# Altium schematic sheet balancingrobot.SchDoc: Balancing Robot
size A4; Organization: HCMUT; Address1: 268 Li Thuong Kiet; Address2: District 10; Address3: Ho Chi Minh City; Address4: Viet Nam; Revision: 1.0.0; SheetNumber: 1; SheetTotal: 1
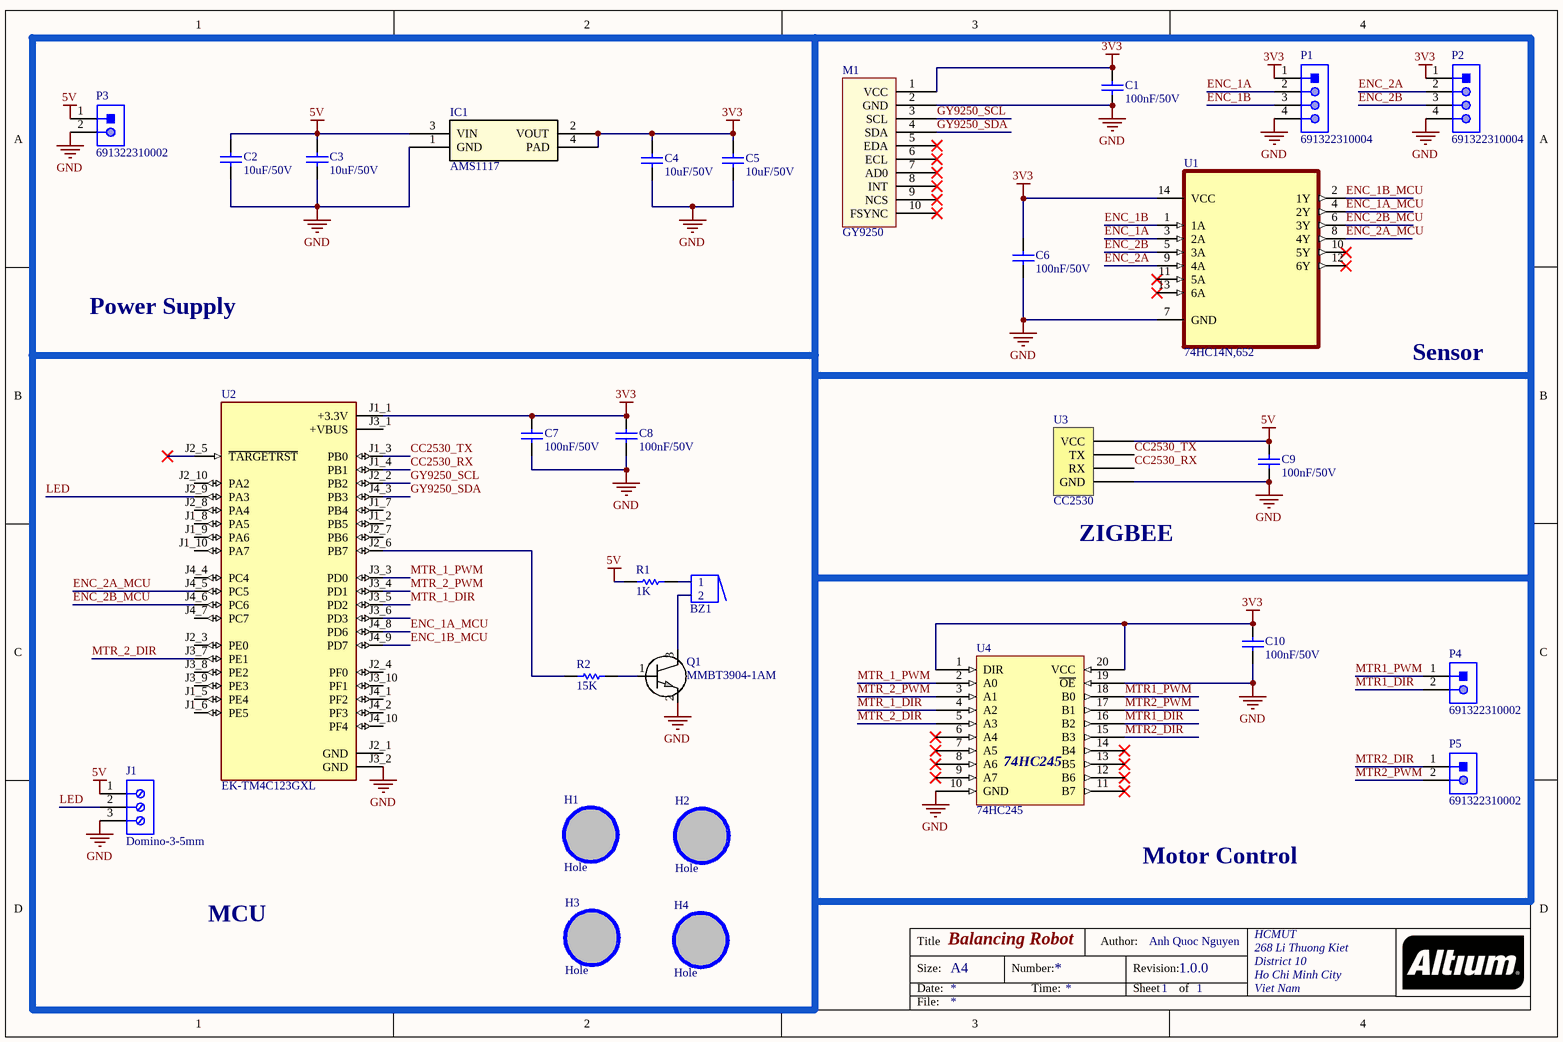
[diagram p0: balancingrobot.SchDoc]

## Parts
BZ1  Buzzer  [BUZZER]  (value not drawn)
C1  value 100nF/50V  [CAP-SM-0805]  (hidden comment: Cap-100nF-50V-0805)
C2  value 10uF/50V  [CAP-SM-0805]  (hidden comment: Cap-10uF-50V-0805)
C3  value 10uF/50V  [CAP-SM-0805]  (hidden comment: Cap-10uF-50V-0805)
C4  value 10uF/50V  [CAP-SM-0805]  (hidden comment: Cap-10uF-50V-0805)
C5  value 10uF/50V  [CAP-SM-0805]  (hidden comment: Cap-10uF-50V-0805)
C6  value 100nF/50V  [CAP-SM-0805]  (hidden comment: Cap-100nF-50V-0805)
C7  value 100nF/50V  [CAP-SM-0805]  (hidden comment: Cap-100nF-50V-0805)
C8  value 100nF/50V  [CAP-SM-0805]  (hidden comment: Cap-100nF-50V-0805)
C9  value 100nF/50V  [CAP-SM-0805]  (hidden comment: Cap-100nF-50V-0805)
C10  value 100nF/50V  [CAP-SM-0805]  (hidden comment: Cap-100nF-50V-0805)
H1  Hole  [LO KHOAN 3MM]
H2  Hole  [LO KHOAN 3MM]
H3  Hole  [LO KHOAN 3MM]
H4  Hole  [LO KHOAN 3MM]
IC1  AMS1117  [SOT223_AMS111700]
J1  Domino-3-5mm  [DOMINO-3-5mm]
M1  GY9250  [GY9250]
P1  691322310004  [691322310004]
P2  691322310004  [691322310004]
P3  691322310002  [691322310002]
P4  691322310002  [691322310002]
P5  691322310002  [691322310002]
Q1  MMBT3904-1AM  [SOT23_NEX]
R1  value 1K  [RES-SM-0805]  (hidden comment: Res-1K-0805)
R2  value 15K  [RES-SM-0805]  (hidden comment: Res-15K-0805)
U1  74HC14N,652  [DIP254P762X420-14]
U2  EK-TM4C123GXL  [MODULE_EK-TM4C123GXL]
U3  CC2530  [CC2530]
U4  74HC245  [dip20]

## Nets
3V3: C1.2 C4.2 C5.2 C6.2 C7.2 C8.2 C10.2 IC1.2(VOUT) IC1.4(PAD) M1.1(VCC) P1.1 P2.1 U1.14(VCC) U2.J1_1(+3.3V) U4.1(DIR) U4.20(VCC)
5V: C2.2 C3.2 C9.2 IC1.3(VIN) J1.1 P3.1 R1.2 U3.1(VCC)
GND: C1.1 C2.1 C3.1 C4.1 C5.1 C6.1 C7.1 C8.1 C9.1 C10.1 IC1.1(GND) J1.3 M1.2(GND) P1.4 P2.4 P3.2 Q1.2 U1.7(GND) U2.J3_2(GND) U3.4(GND) U4.10(GND) U4.19(~{OE})
CC2530_RX: U2.J1_4(PB1) U3.3(RX)
CC2530_TX: U2.J1_3(PB0) U3.2(TX)
ENC_1A: P1.2 U1.3(2A)
ENC_1A_MCU: U1.4(2Y) U2.J4_8(PD6)
ENC_1B: P1.3 U1.1(1A)
ENC_1B_MCU: U1.2(1Y) U2.J4_9(PD7)
ENC_2A: P2.2 U1.9(4A)
ENC_2A_MCU: U1.8(4Y) U2.J4_5(PC5)
ENC_2B: P2.3 U1.5(3A)
ENC_2B_MCU: U1.6(3Y) U2.J4_6(PC6)
GY9250_SCL: M1.3(SCL) U2.J2_2(PB2)
GY9250_SDA: M1.4(SDA) U2.J4_3(PB3)
LED: J1.2 U2.J2_9(PA3)
MTR1_DIR: P4.2 U4.16(B2)
MTR1_PWM: P4.1 U4.18(B0)
MTR2_DIR: P5.1 U4.15(B3)
MTR2_PWM: P5.2 U4.17(B1)
MTR_1_DIR: U2.J3_5(PD2) U4.4(A2)
MTR_1_PWM: U2.J3_3(PD0) U4.2(A0)
MTR_2_DIR: U2.J3_7(PE1) U4.5(A3)
MTR_2_PWM: U2.J3_4(PD1) U4.3(A1)
NetBZ1_1: BZ1.1 R1.1
NetBZ1_2: BZ1.2 Q1.3
NetQ1_1: Q1.1 R2.2
NetR2_1: R2.1 U2.J2_6(PB7)

Not connected (* = marked no-connect by the designer): H1 1; H2 1; H3 1; H4 1; M1 5(EDA)* 6(ECL)* 7(AD0)* 8(INT)* 9(NCS)* 10(FSYNC)*; U1 10(5Y)* 11(5A)* 12(6Y)* 13(6A)*; U2 J1_2(PB5) J1_5(PE4) J1_6(PE5) J1_7(PB4) J1_8(PA5) J1_9(PA6) J1_10(PA7) J2_1(GND) J2_3(PE0) J2_4(PF0) J2_5(~{TARGETRST})* J2_7(PB6) J2_8(PA4) J2_10(PA2) J3_1(+VBUS) J3_6(PD3) J3_8(PE2) J3_9(PE3) J3_10(PF1) J4_1(PF2) J4_2(PF3) J4_4(PC4) J4_7(PC7) J4_10(PF4); U4 6(A4)* 7(A5)* 8(A6)* 9(A7)* 11(B7)* 12(B6)* 13(B5)* 14(B4)*

## Notes on the sheet
- Power Supply
- Sensor
- (near U3) ZIGBEE
- MCU
- Motor Control
- Author:
- Anh Quoc Nguyen
- Title
- Size:
- Date:
- A4
- Number:
- Time:
- Revision:
- Sheet
- of
- File:

## Library data of the parts
C1 C6-C10 = Cap-100nF-50V-0805: CAP CER 0.1UF 50V Y5V 0805; Manufacturer: Samsung Electro-Mechanics; Manufacturer Part Number: CL21F104ZBCNNNC; Local Supplier: thegioiic; Local Supplier Link: https://thegioiic.com/products/tu-100nf-0-1uf-50v-0805; Supplier 1: Digikey; Supplier 1 Part Number: 1276-1007-1-ND; Supplier 1 Link: https://www.digikey.com/product-detail/en/samsung-electro-mechanics/CL21F104ZBCNNNC/1276-1007-1-ND/3889093
C2-C5 = Cap-10uF-50V-0805: CAP CER 10UF 50V X5R 0805; Manufacturer: Yageo; Manufacturer Part Number: CC0805KKX5R9BB106; Local Supplier: thegioiic; Local Supplier Link: https://thegioiic.com/products/tu-10uf-50v-0805; Supplier 1: Digikey; Supplier 1 Link: https://www.digikey.com/product-detail/en/yageo/CC0805KKX5R9BB106/311-3499-2-ND/7164383; Supplier 1 Part Number: 311-3499-2-ND
H1-H4 = Hole: Hole 3mm
IC1 = AMS1117: Manufacturer_Part_Number: AMS1117-5.0; SourceLibrary: Advanced_Monolithic_Systems_2020-02-13; Built_By: EMA_Kyle; Vendor: Advanced Monolithic Systems; Copyright: Copyright (C) 2018 Accelerated Designs. All rights reserved; RefDes: RefDes; Type: DEV
J1 = Domino-3-5mm: WR-TBL Serie 1347 Horizontal Cable Entry, Pressure Clamp, pitch 5mm, 3p; Part Number: 691134710003; Compliance: Lead free / RoHS; Modularity: Yes; PCB/Cable/Panel: PCB; Pin Number: 3; Rated Current [UL]: 16A; Working Voltage [UL]: 300VAC; ComponentLink1Description: Manufacturer; ComponentLink1URL: http://www.we-online.de; ComponentLink2URL: https://katalog.we-online.de/em/datasheet/691134710003.pdf; ComponentLink2Description: Datasheet; Mounting Technology: THT; Packaging: Box; Operating Temperature: -30 to +120degC; Pitch: 5mm; Published Date: October 2019; Type: Horizontal; Publisher: Wurth Elektronik; Application: Pressure Clamp
P1 P2 = 691322310004: WR-TBL Serie 322 Horizontal PCB Header, Pluggable, pitch 3.81mm, 4p; Compliance: RoHS; Modularity: No; Pin Number: 4; Rated Current [UL]: 10A; Working Voltage [UL]: 300VAC; ComponentLink1Description: Manufacturer; ComponentLink1URL: http://www.we-online.de; ComponentLink2URL: https://katalog.we-online.de/em/datasheet/691322310004.pdf; ComponentLink2Description: Datasheet; Mounting Technology: THT; Part Number: 691322310004; Packaging: Box; Operating Temperature: -40 to +105degC; PCB/Cable/Panel: PCB; Pitch: 3.81mm; Published Date: October 2019; Type: Horizontal; Publisher: Wurth Elektronik; Application: Pluggable
P3-P5 = 691322310002: WR-TBL Serie 322 Horizontal PCB Header, Pluggable, pitch 3.81mm, 2p; Compliance: RoHS; Modularity: No; Pin Number: 2; Rated Current [UL]: 10A; Working Voltage [UL]: 300VAC; ComponentLink1Description: Manufacturer; ComponentLink1URL: http://www.we-online.de; ComponentLink2URL: https://katalog.we-online.de/em/datasheet/691322310002.pdf; ComponentLink2Description: Datasheet; Mounting Technology: THT; Part Number: 691322310002; Packaging: Box; Operating Temperature: -40 to +105degC; PCB/Cable/Panel: PCB; Pitch: 3.81mm; Published Date: October 2019; Type: Horizontal; Publisher: Wurth Elektronik; Application: Pluggable
Q1 = MMBT3904-1AM: Vendor: Nexperia; SourceLibrary: Nexperia_2018-05-2018; Type: DEV; Manufacturer_Part_Number: MMBT3904; Copyright: Copyright (C) 2016 Accelerated Designs. All rights reserved; RefDes: RefDes
R1 = Res-1K-0805: RES 1K OHM 1% 1/4W 0805; Manufacturer: Stackpole Electronics Inc; Manufacturer Part Number: RNCP0805FTD1K00; Local Supplier: thegioiic; Local Supplier Link: https://thegioiic.com/products/dien-tro-1k-ohm-0805-5; Supplier 1: Digikey; Supplier 1 Link: https://www.digikey.com/product-detail/en/stackpole-electronics-inc/RNCP0805FTD1K00/RNCP0805FTD1K00CT-ND/2240568; Supplier 1 Part Number: RNCP0805FTD1K00CT-ND
R2 = Res-15K-0805: RES 15K OHM 1% 1/4W 0805; Manufacturer: TE Connectivity Passive Product; Manufacturer Part Number: CRGCQ0805F15K; Local Supplier: thegioiic; Local Supplier Link: https://thegioiic.com/products/dien-tro-15k-ohm-0805-1; Supplier 1: Digikey; Supplier 1 Part Number: A129763CT-ND; Supplier 1 Link: https://www.digikey.com/product-detail/en/te-connectivity-passive-product/CRGCQ0805F15K/A129763CT-ND/8577595
U1 = 74HC14N,652: Inverter IC 6 Channel Schmitt Trigger 14-DIP; MF: NXP USA; MP: 74HC14N,652; Availability: Bad; SnapEDA_Link: https://www.snapeda.com/parts/74HC14N,652/NXP%20USA%20Inc./view-part/2774194/?ref=snap; Value: *; Price: None; Package: DIP-14 Nexperia
U2 = EK-TM4C123GXL: ARMÂ® CortexÂ®-M4F Based MCU TM4C123G LaunchPadâ„¢ Evaluation Kit; MF: Texas Instruments; Price: None; Package: None; Purchase-URL: https://pricing.snapeda.com/search/part/EK-TM4C123GXL/?ref=eda; MP: EK-TM4C123GXL; Availability: Warning; SnapEDA_Link: https://www.snapeda.com/parts/EK-TM4C123GXL/Texas%20Instruments/view-part/132968/?ref=snap; Check_prices: https://www.snapeda.com/parts/EK-TM4C123GXL/Texas%20Instruments/view-part/132968/?ref=eda; Value: *
U3 = Zigbee CC2530: Zigbee
U4 = 74HC245: Dán; Ten_Linh_Kien: 74HC245DW SSOP20 5.2MM; Don_Vi: Con; Ma_Hang: MH003571; Ghi_Chu: *; Kieu_Chan: *; Chung_Loai: Dán
M1 = GY9250: Local Supplier: HShop; Local Supplier Link: https://hshop.vn/products/cam-bien-gy-9250-9dof-imu-mpu9250; Local Supplier Part Number: *; Manufacturer: *; Manufacturer Part Number: *